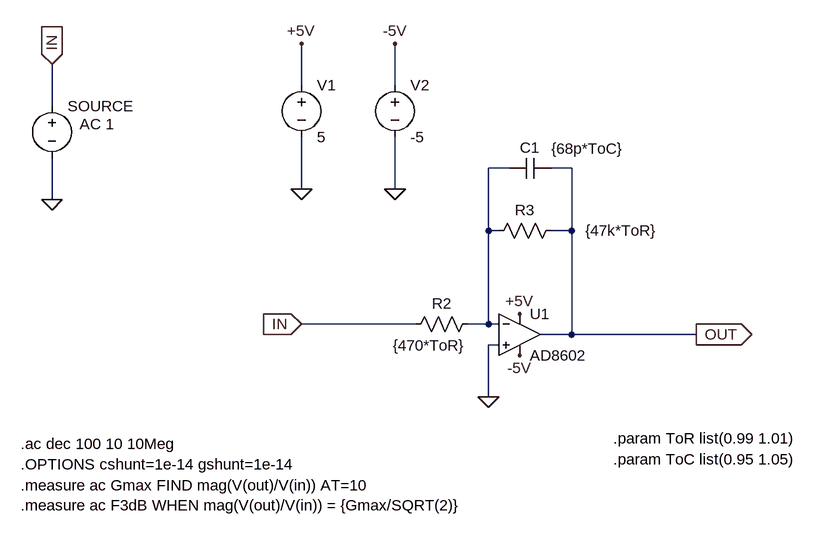
[diagram p0: schematic g_min100_bw_50k_worst_case.asc]
g_min100_bw_50k_worst_case.asc, the LTspice schematic file:
Version 4.1
SHEET 1 884 680
WIRE 96 -128 96 -192
WIRE 240 -128 240 -192
WIRE -288 -96 -288 -160
WIRE 416 0 384 0
WIRE 512 0 480 0
WIRE 96 32 96 -48
WIRE 240 32 240 -48
WIRE -288 48 -288 -16
WIRE 384 96 384 0
WIRE 400 96 384 96
WIRE 512 96 512 0
WIRE 512 96 480 96
WIRE 272 240 96 240
WIRE 384 240 384 96
WIRE 384 240 352 240
WIRE 400 240 384 240
WIRE 512 256 512 96
WIRE 512 256 464 256
WIRE 704 256 512 256
WIRE 400 272 384 272
WIRE 384 352 384 272
FLAG 96 -192 +5V
FLAG 240 -192 -5V
FLAG 96 32 0
FLAG 240 32 0
FLAG 96 240 IN
IOPIN 96 240 In
FLAG 384 352 0
FLAG 432 288 -5V
FLAG 432 224 +5V
FLAG 704 256 OUT
IOPIN 704 256 Out
FLAG -288 -160 IN
IOPIN -288 -160 In
FLAG -288 48 0
SYMBOL OpAmps\\AD8602 432 192 R0
SYMATTR InstName U1
SYMBOL voltage 96 -144 R0
WINDOW 123 0 0 Left 0
WINDOW 39 0 0 Left 0
SYMATTR InstName V1
SYMATTR Value 5
SYMBOL voltage 240 -144 R0
WINDOW 123 0 0 Left 0
WINDOW 39 0 0 Left 0
SYMATTR InstName V2
SYMATTR Value -5
SYMBOL res 368 224 R90
WINDOW 0 0 56 VBottom 2
WINDOW 3 33 75 VTop 2
SYMATTR InstName R2
SYMATTR Value {470*ToR}
SYMBOL res 496 80 R90
WINDOW 0 0 56 VBottom 2
WINDOW 3 0 -92 VTop 2
SYMATTR InstName R3
SYMATTR Value {47k*ToR}
SYMBOL voltage -288 -112 R0
WINDOW 123 43 44 Left 2
WINDOW 39 0 0 Left 0
WINDOW 3 43 72 Left 2
SYMATTR Value2 AC 1
SYMATTR Value ""
SYMATTR InstName SOURCE
SYMBOL cap 480 -16 R90
WINDOW 0 0 32 VBottom 2
WINDOW 3 -30 -57 VTop 2
SYMATTR InstName C1
SYMATTR Value {68p*ToC}
SYMATTR SpiceLine V=50
TEXT -336 424 Left 2 !.ac dec 100 10 10Meg
TEXT -336 456 Left 2 !.OPTIONS cshunt=1e-14 gshunt=1e-14
TEXT -336 488 Left 2 !.measure ac Gmax FIND mag(V(out)/V(in)) AT=10\n.measure ac F3dB WHEN mag(V(out)/V(in)) = {Gmax/SQRT(2)}
TEXT 576 416 Left 2 !.param ToR list(0.99 1.01)
TEXT 576 448 Left 2 !.param ToC list(0.95 1.05)

The netlist it stands for:
* g_min100_bw_50k_worst_case.asc
X§U1 0 N001 +5V -5V OUT AD8602  ; pins In+ In- V+ V- OUT
V1 +5V 0 5
V2 -5V 0 -5
R2 N001 IN {470*ToR}
R3 OUT N001 {47k*ToR}
V§SOURCE IN 0 AC 1
C1 OUT N001 {68p*ToC} V=50
.ac dec 100 10 10Meg
.OPTIONS cshunt=1e-14 gshunt=1e-14
.measure ac Gmax FIND mag(V(out)/V(in)) AT=10
.measure ac F3dB WHEN mag(V(out)/V(in)) = {Gmax/SQRT(2)}
.param ToR list(0.99 1.01)
.param ToC list(0.95 1.05)
.backanno
.end